# Altium schematic sheet IT_Asset_Tracking_Rack_Controller-H743.SchDoc: IT_Asset_Tracking_Rack_Controller-H743
size A3; Engineer: Attila Horvath; Organization: Reichle & De-Massari; Address1: Binzstrasse 32; Address2: 8620 Wetzikon; Address3: Switzerland; DocumentNumber: 1; Revision: V0.1; SheetNumber: 1; SheetTotal: 11
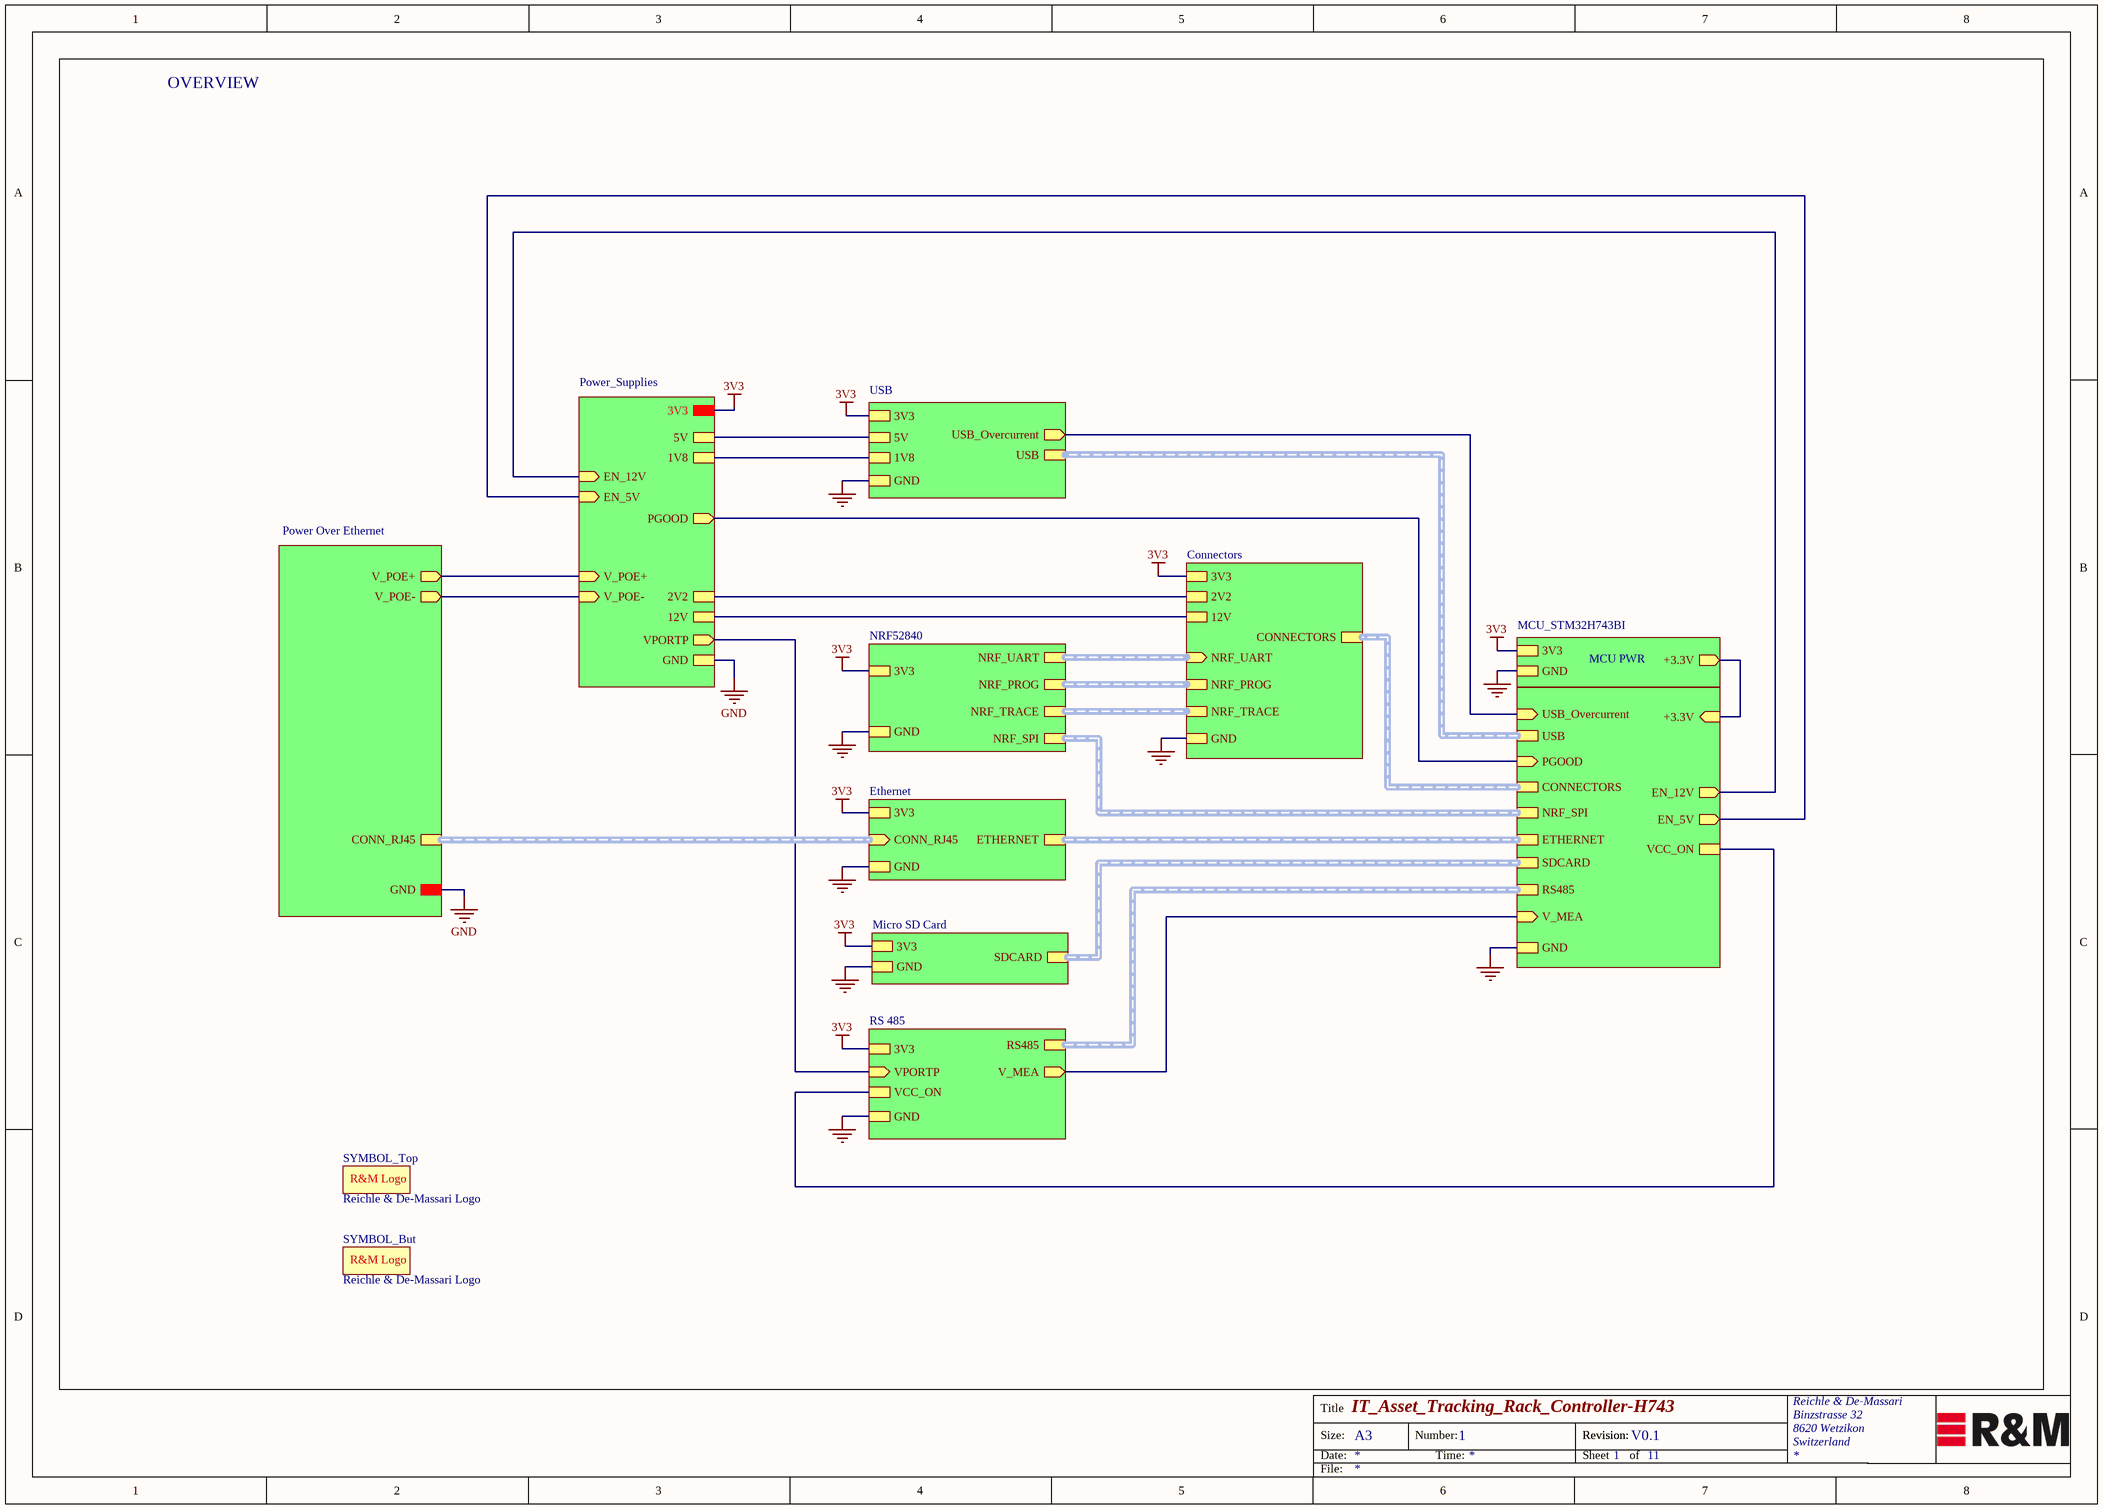
[diagram p0: IT_Asset_Tracking_Rack_Controller-H743.SchDoc]

## Parts
SYMBOL_But  Reichle & De-Massari Logo  [SYMBOL_R&M]  (net tie)
SYMBOL_Top  Reichle & De-Massari Logo  [SYMBOL_R&M]  (net tie)

## Sub-sheets
Connectors = Connectors.SchDoc: NRF_UART (in, harness NRF_UART), NRF_PROG (harness NRF_PROG), NRF_TRACE (harness NRF_TRACE), CONNECTORS (harness CONNECTORS), 3V3, 2V2, 12V, GND
Ethernet = Ethernet.SchDoc: 3V3, GND, CONN_RJ45 (in, harness CONN_RJ45), ETHERNET (harness ETHERNET)
MCU PWR = MCU_STM32H743BI_POWER.SchDoc: 3V3, GND, +3.3V (out)
MCU_STM32H743BI = MCU_STM32H743BI.SchDoc: USB (harness USB), ETHERNET (harness ETHERNET), SDCARD (harness SD_CARD), NRF_SPI (harness NRF_SPI), USB_Overcurrent (in), RS485 (harness MCU_RS485), EN_12V (out), EN_5V (out), V_MEA (in), GND, CONNECTORS (harness CONNECTORS), +3.3V (in), PGOOD (in), VCC_ON
Micro SD Card = Micro_SD_Card.SchDoc: 3V3, GND, SDCARD (harness SD_CARD)
NRF52840 = NRF52840.SchDoc: 3V3, GND, NRF_TRACE (harness NRF_TRACE), NRF_SPI (harness NRF_SPI), NRF_UART (harness NRF_UART), NRF_PROG (harness NRF_PROG)
Power Over Ethernet = Power_Over_Ethernet.SchDoc: V_POE+ (out), V_POE- (out), CONN_RJ45 (harness CONN_RJ45), GND
Power_Supplies = Power_Supplies.SchDoc: 3V3, 5V, 1V8, 2V2, 12V, V_POE- (in), V_POE+ (in), EN_5V (in), EN_12V (in), GND, PGOOD (out), VPORTP (out)
RS 485 = RS-485.SchDoc: 3V3, GND, RS485 (harness MCU_RS485), V_MEA (out), VCC_ON, VPORTP (in)
USB = USB.SchDoc: 1V8, 3V3, 5V, USB (harness USB), USB_Overcurrent (out), GND

## Nets
3V3: sheet USB/3V3, sheet Ethernet/3V3, sheet MCU PWR/3V3, sheet Micro SD Card/3V3, sheet NRF52840/3V3, sheet RS 485/3V3, sheet Connectors/3V3, sheet Power_Supplies/3V3
GND: sheet Power Over Ethernet/GND, sheet USB/GND, sheet Ethernet/GND, sheet MCU_STM32H743BI/GND, sheet MCU PWR/GND, sheet Micro SD Card/GND, sheet NRF52840/GND, sheet RS 485/GND, sheet Connectors/GND, sheet Power_Supplies/GND
(unnamed): sheet Power Over Ethernet/V_POE+, sheet Power_Supplies/V_POE+
(unnamed): sheet Power Over Ethernet/V_POE-, sheet Power_Supplies/V_POE-
(unnamed): sheet USB/1V8, sheet Power_Supplies/1V8
(unnamed): sheet USB/5V, sheet Power_Supplies/5V
(unnamed): sheet USB/USB_Overcurrent, sheet MCU_STM32H743BI/USB_Overcurrent
(unnamed): sheet MCU_STM32H743BI/EN_12V, sheet Power_Supplies/EN_12V
(unnamed): sheet MCU_STM32H743BI/EN_5V, sheet Power_Supplies/EN_5V
(unnamed): sheet MCU_STM32H743BI/V_MEA, sheet RS 485/V_MEA
(unnamed): sheet MCU_STM32H743BI/+3.3V, sheet MCU PWR/+3.3V
(unnamed): sheet MCU_STM32H743BI/PGOOD, sheet Power_Supplies/PGOOD
(unnamed): sheet MCU_STM32H743BI/VCC_ON, sheet RS 485/VCC_ON
(unnamed): sheet RS 485/VPORTP, sheet Power_Supplies/VPORTP
(unnamed): sheet Connectors/2V2, sheet Power_Supplies/2V2
(unnamed): sheet Connectors/12V, sheet Power_Supplies/12V

## Buses and harness runs
harness sheet Connectors/CONNECTORS = sheet MCU_STM32H743BI/CONNECTORS
harness sheet Connectors/NRF_PROG = sheet NRF52840/NRF_PROG
harness sheet Connectors/NRF_TRACE = sheet NRF52840/NRF_TRACE
harness sheet Connectors/NRF_UART = sheet NRF52840/NRF_UART
harness sheet Ethernet/CONN_RJ45 = sheet Power Over Ethernet/CONN_RJ45
harness sheet Ethernet/ETHERNET = sheet MCU_STM32H743BI/ETHERNET
harness sheet MCU_STM32H743BI/NRF_SPI = sheet NRF52840/NRF_SPI
harness sheet MCU_STM32H743BI/RS485 = sheet RS 485/RS485
harness sheet MCU_STM32H743BI/SDCARD = sheet Micro SD Card/SDCARD
harness sheet MCU_STM32H743BI/USB = sheet USB/USB

## Notes on the sheet
- OVERVIEW
- Title
- Size:
- Date:
- A3
- Number:
- Time:
- Revision:
- Sheet
- of
- File:
- (in symbol SYMBOL_R&M) R&M Logo

## Library data of the parts
SYMBOL_But SYMBOL_Top = SYMBOL_R&M: Replaceable: no; value: Overlay; Footprint/Package: 2.54mm